# EAGLE design LLC_Demo_Board (EAGLE 9.5.2)
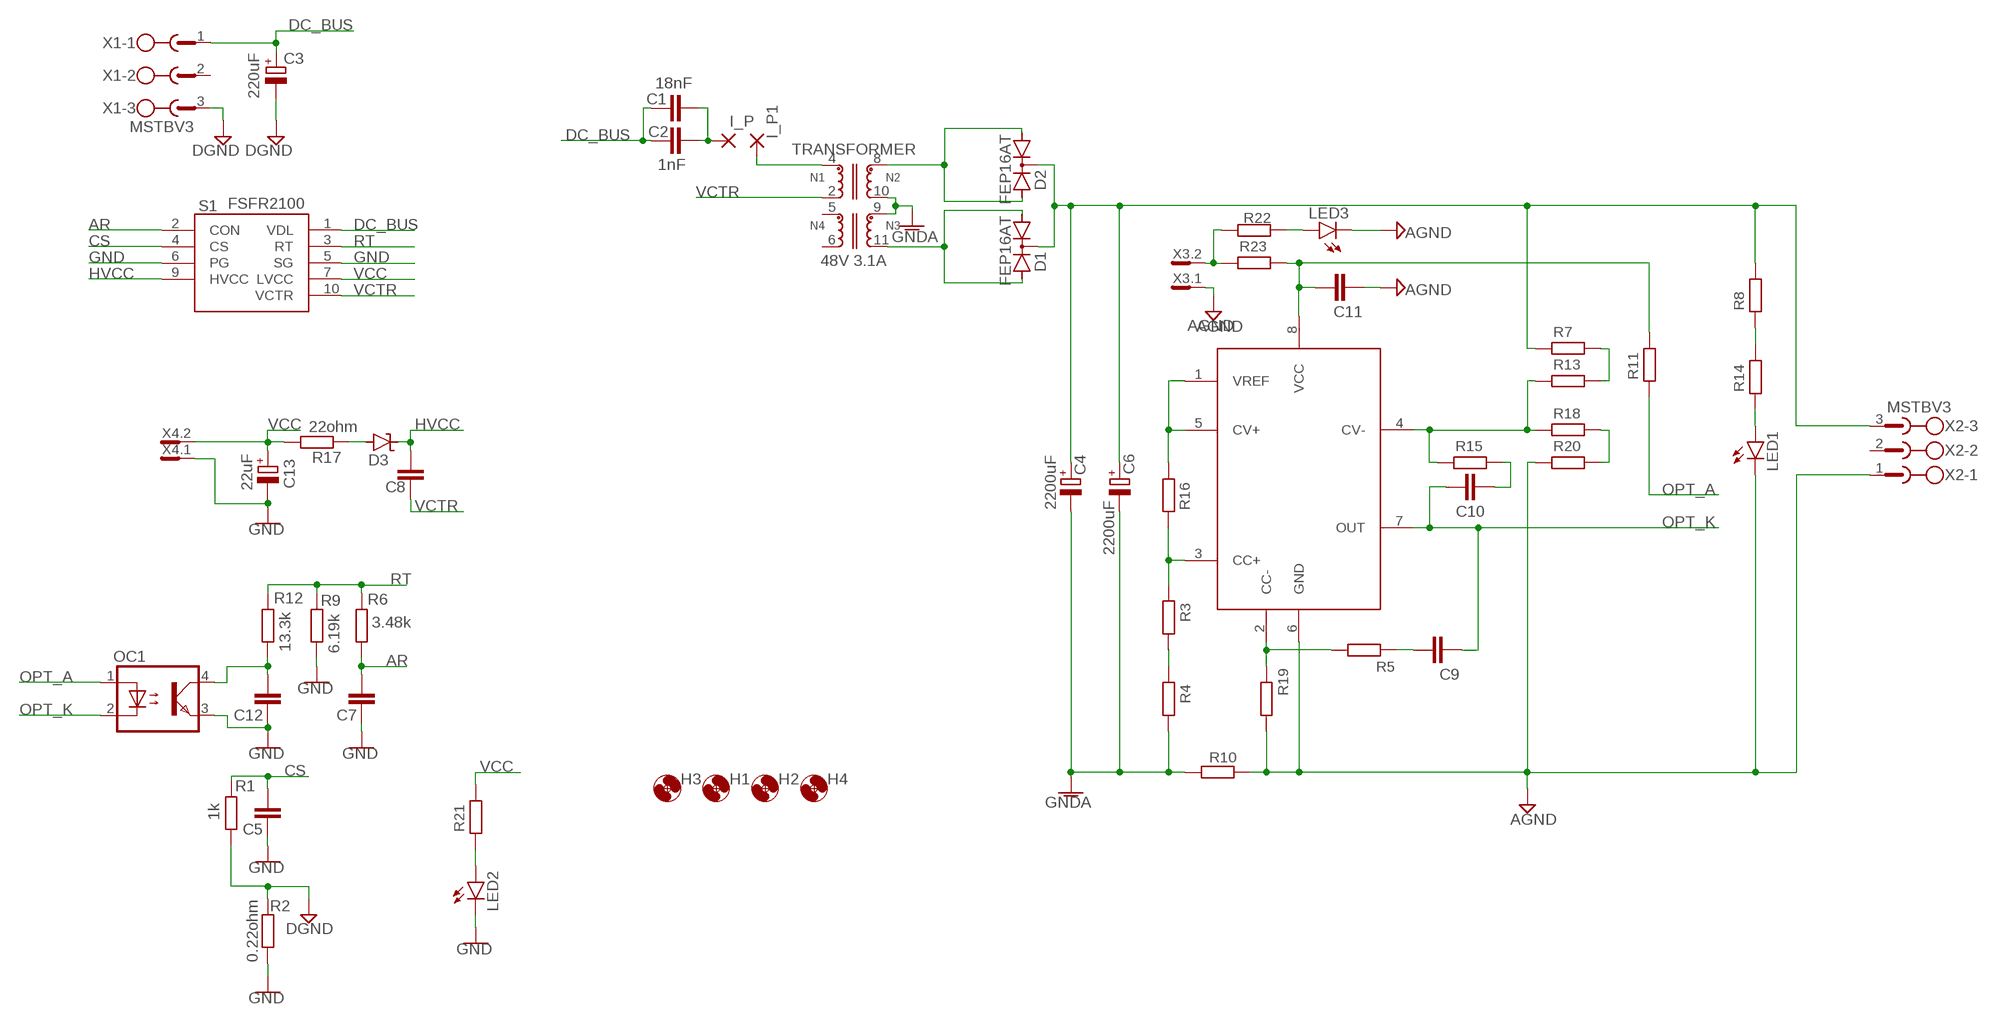
[diagram p0: schematic, sheet 1]

## Parts
C1  18nF  C-EU075-063X106  [C075-063X106]
C2  1nF  C-EU150-072X183  [C150-072X183]
C3  220uF  CPOL-EUE10-30  [EB30D]
C4  2200uF  CPOL-EUE7.5-18  [E7,5-18]
C5  100pF  C-EUC0805  [C0805]
C6  2200uF  CPOL-EUE7.5-18  [E7,5-18]
C7  220nF  C-EUC0805  [C0805]
C8  150nF  C-EUC1206  [C1206]
C9  2.2nF  C-EUC1206  [C1206]
C10  2.2nF  C-EUC1206  [C1206]
C11  22uF  C-EUC0805  [C0805]
C12  12nF  C-EUC0805  [C0805]
C13  22uF  CPOL-EU153CLV-0605  [153CLV-0605]
D1  FEP16AT  [TO220ABS]
D2  FEP16AT  [TO220ABS]
D3  SUPPRESSOR-SMBJ  [SMBJ]
H1  MOUNT-HOLE4.1  [4,1]
H2  MOUNT-HOLE4.1  [4,1]
H3  MOUNT-HOLE4.1  [4,1]
H4  MOUNT-HOLE4.1  [4,1]
I_P  3,81/1,4  [3,81/1,4]
I_P1  3,81/1,4  [3,81/1,4]
IC1  1039-2224 / TSM1011ID SO-8 Constant Voltage and Constant Current Controller  TSM1011  [SO-8]
LED1  LED5MM  [LED5MM]
LED2  LED5MM  [LED5MM]
LED3  LED5MM  [LED5MM]
OC1  1039-2189 / Opto coupler CEL-Renesas PS2561DL2-1Y-V-E3-A (8mm creepage ) CTR:50-400  PS2561DL2-1_OPTO  [PS2561DL2-1_OPTO]
R1  1k  R-EU_R0805  [R0805]
R2  0.22ohm  R-EU_R2512  [R2512]
R3  500ohm  R-EU_R0805  [R0805]
R4  500ohm  R-EU_R0805  [R0805]
R5  22k  R-EU_R1206  [R1206]
R6  3.48k  R-EU_R0805  [R0805]
R7  180k  R-EU_R1206  [R1206]
R8  1029-3175 / RES 0805 22K %1  R-EU_R1206  [R1206]
R9  6.19k  R-EU_R0805  [R0805]
R10  50m  R-EU_R2512  [R2512]
R11  100ohm  R-EU_R1206  [R1206]
R12  13.3k  R-EU_R0805  [R0805]
R13  12k  R-EU_R1206  [R1206]
R14  1029-3175 / RES 0805 22K %1  R-EU_R1206  [R1206]
R15  22k  R-EU_R1206  [R1206]
R16  15k  R-EU_R0805  [R0805]
R17  22ohm  R-EU_R0805  [R0805]
R18  4.99k  R-EU_R1206  [R1206]
R19  1k  R-EU_R0805  [R0805]
R20  4.99k  R-EU_R1206  [R1206]
R21  1029-3175 / RES 0805 22K %1  R-EU_R1206  [R1206]
R22  1029-3175 / RES 0805 22K %1  R-EU_R1206  [R1206]
R23  1k  R-EU_R1206  [R1206]
S1  FSFR2100  [FSFR2100]
TRANSFORMER  48V 3.1A  WE-LLCR_ETD34_760895451  [WE-LLCR_ETD34]
X1  MSTBV3  [MSTBV3]
X2  MSTBV3  [MSTBV3]
X3  İKİLİ MOLEX  MCV2  [MCV2]
X4  İKİLİ MOLEX  MCV2  [MCV2]

## Nets
AGND: C11.1 IC1.6(GND) LED1.K(C) LED3.K(C) R10.2 R19.1 R20.2 X2.1 X3.1
AR: C7.1 R6.2 S1.2(CON)
CS: C5.1 R1.2 S1.4(CS)
DC_BUS: C1.1 C2.1 C3.+ S1.1(VDL) X1.1
DGND: C3.- R1.1 R2.2 X1.3
GND: C5.2 C7.2 C12.2 C13.- LED2.K(C) OC1.3 R2.1 R9.2 S1.5(SG) S1.6(PG) X4.1
GNDA: C4.- C6.- R4.1 R10.1 TRANSFORMER.9 TRANSFORMER.10
HVCC: C8.1 D3.C S1.9(HVCC)
N$1: R22.1 R23.2 X3.2
N$2: C1.2 C2.2 I_P.1(P)
N$3: R8.2 R14.1
N$4: D3.A R17.1
N$5: D1.A1 D1.A2 TRANSFORMER.11
N$6: D2.A1 D2.A2 TRANSFORMER.8
N$7: C12.1 OC1.4 R12.2
N$8: LED2.A R21.2
N$9: LED1.A R14.2
N$10: LED3.A R22.2
N$18: I_P1.1(P) TRANSFORMER.4
N$19: IC1.1(VREF) IC1.5(CV+) R16.2
N$36: C9.2 R5.2
N$37: C10.2 R15.2
N$38: IC1.4(CV-) R13.2 R15.1 R18.2
N$39: IC1.2(CC-) R5.1 R19.2
N$40: IC1.3(CC+) R3.2 R16.1
N$44: C11.2 IC1.8(VCC) R11.1 R23.1
N$45: R18.1 R20.1
N$55: R7.1 R13.1
N$56: R3.1 R4.2
OPT_A: OC1.1 R11.2
OPT_K: C9.1 C10.1 IC1.7(OUT) OC1.2
RT: R6.1 R9.1 R12.1 S1.3(RT)
VCC: C13.+ R17.2 R21.1 S1.7(LVCC) X4.2
VCTR: C8.2 S1.10(VCTR) TRANSFORMER.2
VDC+: C4.+ C6.+ D1.C D2.C R7.2 R8.1 X2.3
Unconnected: TRANSFORMER.5 TRANSFORMER.6 X1.2 X2.2

## Library data of the parts
C1 C2 = rcl:C-EU: CAPACITOR, European symbol; SPICEPREFIX: C
C3 = rcl:CPOL-EU: POLARIZED CAPACITOR, European symbol; SPICEPREFIX: C
C4 C6 C13 = rcl:CPOL-EU: POLARIZED CAPACITOR, European symbol
C5 C7-C12 = rcl:C-EU: CAPACITOR, European symbol
D1 D2 = diode:FEP16AT: DIODE dual ultra-fast recovery rectifier, common cathode
D3 = diode:SUPPRESSOR-: Suppressor diode
H1-H4 = holes:MOUNT-HOLE: MOUNTING HOLE with drill center marker
I_P I_P1 = wirepad:3,81/1,4: THROUGH-HOLE PAD
IC1 = mutlu:TSM1011
LED1-LED3 = led:LED: LED OSRAM: - CHIPLED LG R971, LG N971, LY N971, LG Q971, LY Q971, LO R971, LY R971 LH N974, LH R974 LS Q976, LO Q976, LY Q976 LO Q996 - Hyper CHIPLED LW Q18S LB Q993, LB Q99A, LB R99A - SideLED LS A670, LO A670, LY A670, LG A670, LP A670 LB A673, LV A673, LT A673, LW A673 LH A674 LY A675 LS A676, LA A676, LO A676, LY A676, LW A676 LS A679, LY A679, LG A679 - Hyper Micro SIDELED® LS Y876, LA Y876, LO Y876, LY Y876 LT Y87S - SmartLED LW L88C, LW L88S LB L89C, LB L89S, LG L890 LS L89K, LO L89K, LY L89K LS L896, LA L896, LO L896, LY L896 - TOPLED LS T670, LO T670, LY T670, LG T670, LP T670 LSG T670, LSP T670, LSY T670, LOP T670, LYG T670 LG T671, LOG T671, LSG T671 LB T673, LV T673, LT T673, LW T673 LH T674 LS T676, LA T676, LO T676, LY T676, LB T676, LH T676, LSB T676, LW T676 LB T67C, LV T67C, LT T67C, LS T67K, LO T67K, LY T67K, LW E67C LS E67B, LA E67B, LO E67B, LY E67B, LB E67C, LV E67C, LT E67C LW T67C LS T679, LY T679, LG T679 LS T770, LO T770, LY T770, LG T770, LP T770 LB T773, LV T773, LT T773, LW T773 LH T774 LS E675, LA E675, LY E675, LS T675 LS T776, LA T776, LO T776, LY T776, LB T776 LHGB T686 LT T68C, LB T68C - Hyper Mini TOPLED® LB M676 - Mini TOPLED Santana® LG M470 LS M47K, LO M47K, LY M47K Source: http://www.osram.convergy.de LUXEON: - LUMILED® LXK2-PW12-R00, LXK2-PW12-S00, LXK2-PW14-U00, LXK2-PW14-V00 LXK2-PM12-R00, LXK2-PM12-S00, LXK2-PM14-U00 LXK2-PE12-Q00, LXK2-PE12-R00, LXK2-PE12-S00, LXK2-PE14-T00, LXK2-PE14-U00 LXK2-PB12-K00, LXK2-PB12-L00, LXK2-PB12-M00, LXK2-PB14-N00, LXK2-PB14-P00, LXK2-PB14-Q00 LXK2-PR12-L00, LXK2-PR12-M00, LXK2-PR14-Q00, LXK2-PR14-R00 LXK2-PD12-Q00, LXK2-PD12-R00, LXK2-PD12-S00 LXK2-PH12-R00, LXK2-PH12-S00 LXK2-PL12-P00, LXK2-PL12-Q00, LXK2-PL12-R00 Source: www.luxeon.com KINGBRIGHT: KA-3528ASYC Source: www.kingbright.com
OC1 = enko:PS2561DL2-1_OPTO
R1-R23 = rcl:R-EU_: RESISTOR, European symbol
S1 = SamacSys_Parts:FSFR2100: Power Switch Hi Side/Lo Side 9-Pin SIP Source: Datasheet <https://www.onsemi.com/pub/Collateral/FSFR2100-D.pdf>; DESCRIPTION: Power Switch Hi Side/Lo Side 9-Pin SIP; HEIGHT: 12mm; MANUFACTURER_NAME: ON Semiconductor; MANUFACTURER_PART_NUMBER: FSFR2100; MOUSER_PART_NUMBER: 512-FSFR2100; MOUSER_PRICE-STOCK: https://www.mouser.co.uk/ProductDetail/ON-Semiconductor-Fairchild/FSFR2100?qs=EsHZHwLKyZ1uSWmF0BsHAQ%3D%3D; RS_PART_NUMBER: 6710185P; RS_PRICE-STOCK: http://uk.rs-online.com/web/p/products/6710185P
TRANSFORMER = 760895451_Eagle_WE-LLCR_rev19a:WE-LLCR_ETD34: WE-LLCR Resonant Converter Characteristics Transformer for high efficiency power supply Input voltage 360–400 VDC Switching frequency 70–120 kHz Output power 150 W–250 W Testing voltage 4 kVAC Litz wire for low eddy current losses Defined leakage inductance for use without additional resonant inductor Applications Power supplies for PC, netbook, LED lighting and other power supplies High efficient resonant converters The "Value"shown for the Symbol and Packaging is Output Voltage1 Output Current1 <https://katalog.we-online.com/media/images/v2/o14804v209%20Family_WE-LLCR.jpg> Details see: https://katalog.we-online.com/en/pbs/WE-LLCR Updated by Yingchun,Shan 2019-08-27 2019(C) Wurth Elektronik; DATASHEET-URL: https://katalog.we-online.com/pbs/datasheet/760895451.pdf; FSWITCH: 70-120kHz; ISAT: 2A; L: 600uH; LSMIN: 100uH; N: 35:8:8:3; PART-NUMBER: 760895451; RDC1: 260mOhm; RDC2: 26.5mOhm; RDC3: 26.5mOhm; RDC4: 145mOhm; VAUX: 18V; VI: 360-400V(DC)
X1 X2 = con-phoenix-508:MSTBV3: PHOENIX; MPN: MSTBV 2,5/3-GF-5.08; OC_FARNELL: 1792793; OC_NEWARK: 69R9846
X3 X4 = con-phoenix-381_l:MCV2: Mini-Combicon 3.81mm vertikal 2polig (ohne Gegenstecker)

## Board
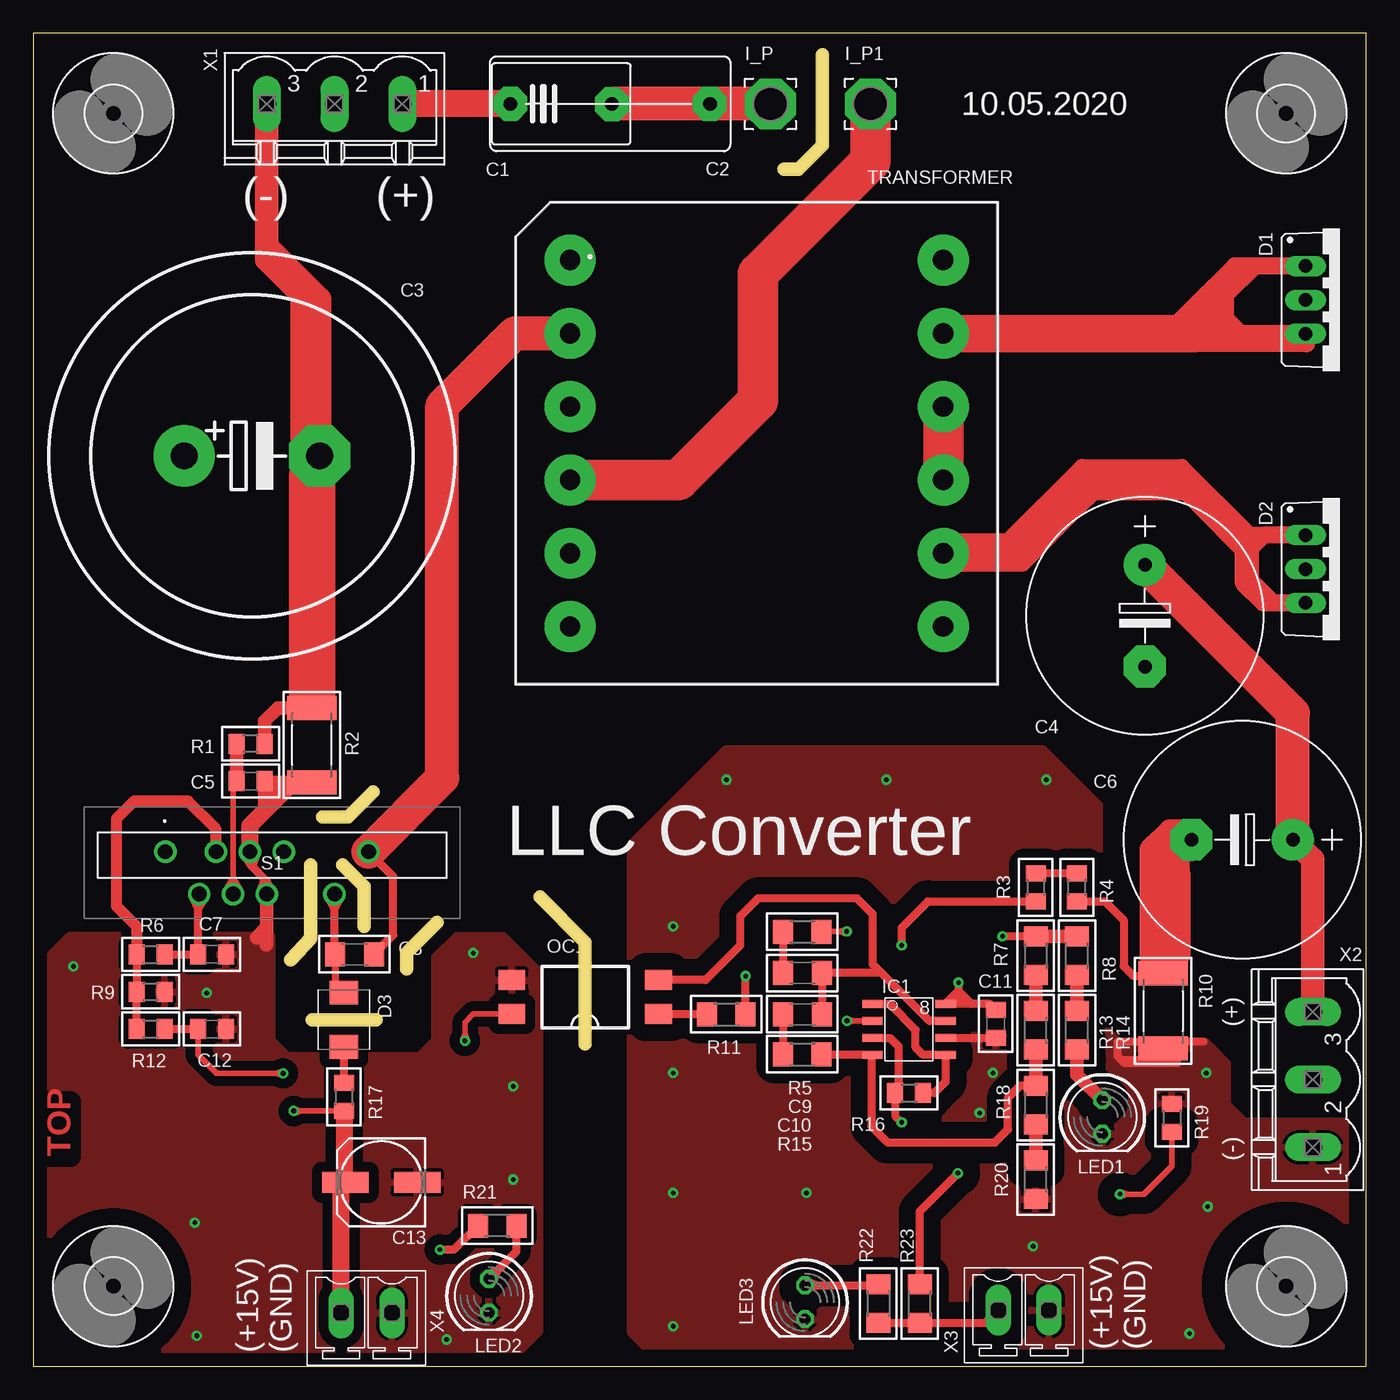
[diagram p1: board, top side]
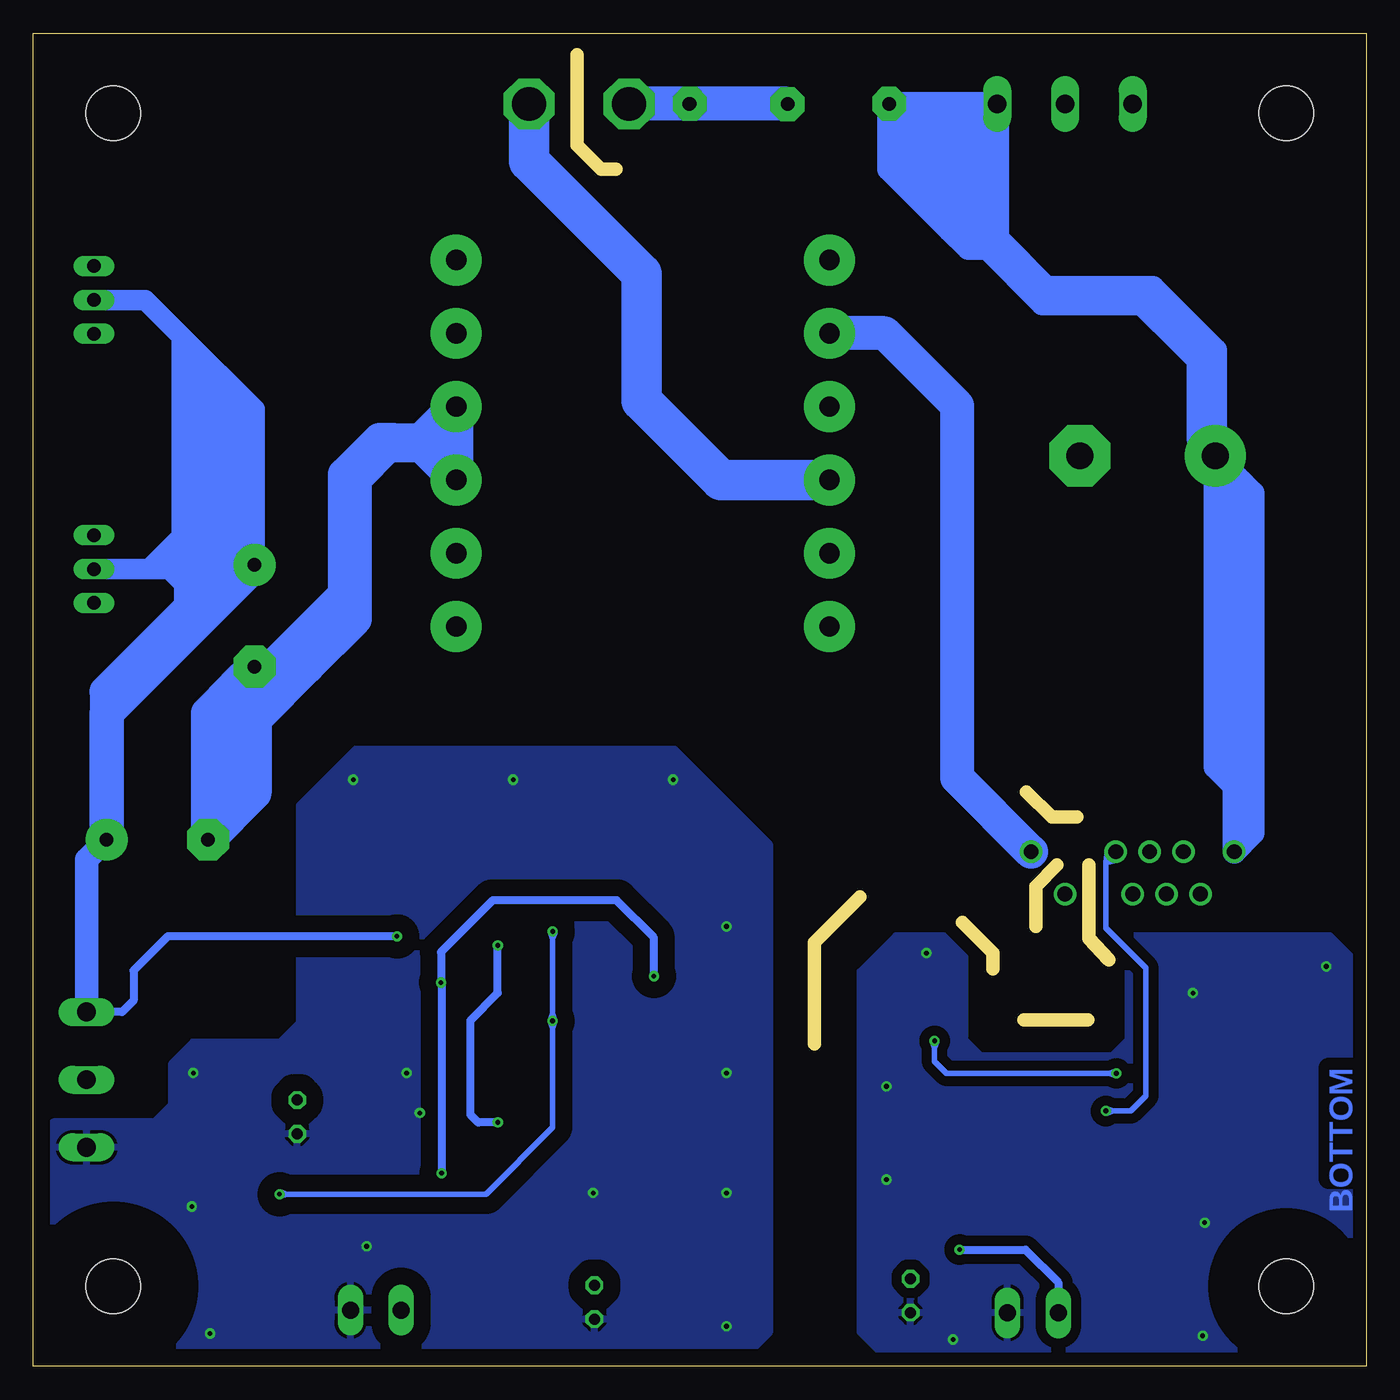
[diagram p2: board, bottom side, seen from below]

Size 100 x 100 mm. Coordinates in mm from the lower left corner, seen from the top.
Outline: 0,0 100,0 100,100 0,100 0,0
Copper layers (1*16): Top 0.035mm / dielectric 1.5mm / Bottom 0.035mm
Design rules "default *": minimum track width 6mil, minimum drill 0.35mm, track to track 30mil, track to pad 30mil, pad to pad 30mil, via to via 30mil, smd to smd 30mil, copper to edge 40mil, drill to drill 6mil, minimum pad ring 10mil, minimum via ring 8mil, stop-mask expansion 4mil, vias tented up to drill 0mil, thermal gap 10mil
Milling: 14 lines

### Footprints (pad centres in the part's own frame; a part is rotated, then mirrored left to right if it is on the bottom)
C075-063X106 = drill 0.914 octagon: 1 -3.81,0; 2 3.81,0
C150-072X183 = drill 1.016 octagon: 1 -7.493,0; 2 7.493,0
EB30D = drill 2.007 pad 4.597: + -5.08,0 | drill 2.007 pad 4.597 octagon: - 5.08,0
E7,5-18 = drill 1.016 pad 3.15: + -3.81,0 | drill 1.016 pad 3.15 octagon: - 3.81,0
C0805 = smd 1.2 x 1.5: 1 -1.05,0; 2 1.05,0
C1206 = smd 1.5 x 1.8: 1 -1.45,0; 2 1.45,0
153CLV-0605 = smd 3.5 x 1.6: + 2.7,0; - -2.7,0
TO220ABS = drill 1.016 long: A1 -2.54,-2.54; A2 2.54,-2.54; C 0,-2.54
SMBJ = smd 1.78 x 2.16: A 2.04,0; C -2.03,0
4,1 = hole 4.1: 0,0
3,81/1,4 = drill 2.54 pad 3.81 octagon: 1 0,0
SO-8 = smd 1.524 x 0.61: 1 -2.743,1.27; 2 -2.743,0; 3 -2.743,-1.27; 4 -2.743,-2.54; 5 2.743,-2.54; 6 2.743,-1.27; 7 2.743,0; 8 2.743,1.27
LED5MM = drill 0.813 octagon: A -1.27,0; K 1.27,0
PS2561DL2-1_OPTO = smd 1.5 x 2: 1 -1.27,-5.5; 2 1.27,-5.5; 3 1.27,5.5; 4 -1.27,5.5
R0805 = smd 1.2 x 1.5: 1 -1.05,0; 2 1.05,0
R2512 = smd 1.8 x 3.7: 1 -2.8,0; 2 2.8,0
R1206 = smd 1.5 x 1.8: 1 -1.447,0; 2 1.447,0
FSFR2100 = drill 1.12 pad 1.68: 1 0,0; 2 2.54,-3.18; 3 3.81,0; 4 5.08,-3.18; 5 6.35,0; 6 7.62,-3.18; 7 8.89,0; 9 12.7,-3.18; 10 15.24,0
WE-LLCR_ETD34 = drill 1.524 pad 3.81: 1 -14,13.75; 2 -14,8.25; 3 -14,2.75; 4 -14,-2.75; 5 -14,-8.25; 6 -14,-13.75; 7 14,-13.75; 8 14,-8.25; 9 14,-2.75; 10 14,2.75; 11 14,8.25; 12 14,13.75
MSTBV3 = drill 1.397 long: 1 -5.08,0; 2 0,0; 3 5.08,0
MCV2 = drill 1.27 pad 1.905 long: 1 -1.905,0; 2 1.905,0

### Placement (x,y rotation side)
C1  39.6,94.72 0 top
C2  43.28,94.72 0 top
C3  16.4,68.3 0 top
C4  83.4,56.3 270 top
C5  16.3,43.9 0 top
C6  90.7,39.5 180 top
C7  13.4,30.9 0 top
C8  24.1,30.9 0 top
C9  57.7,29.5 180 top
C10  57.7,26.4 180 top
C11  72.2,25.7 90 top
C12  13.4,25.3 0 top
C13  26.1,13.8 180 top
D1  98,80 270 top
D2  98,59.8 270 top
D3  23.3,26 270 top
H1  6,94 0 top
H2  94,94 0 top
H3  6,6 0 top
H4  94,6 0 top
I_P  55.3,94.7 0 top
I_P1  62.8,94.7 0 top
IC1  65.7,25.9 0 top
LED1  80.2,18.7 270 top
LED2  34.19,5.28 270 top
LED3  57.9,4.8 270 top
OC1  41.4,27.7 90 top
R1  16.3,46.7 180 top
R2  20.9,46.6 90 top
R3  75.2,35.93 270 top
R4  78.3,35.93 90 top
R5  57.7,32.6 180 top
R6  8.8,30.9 0 top
R7  75.2,30.8 90 top
R8  78.3,30.8 270 top
R9  8.8,28.1 0 top
R10  84.77,26.65 270 top
R11  52,26.4 180 top
R12  8.8,25.3 0 top
R13  75.2,25.2 270 top
R14  78.3,25.2 270 top
R15  57.7,23.4 180 top
R16  65.7,20.5 0 top
R17  23.3,20.2 270 top
R18  75.2,19.6 90 top
R19  85.41,18.63 270 top
R20  75.2,14 270 top
R21  34.8,10.54 0 top
R22  63.4,4.7 90 top
R23  66.5,4.7 270 top
S1  9.9,38.6 0 top
TRANSFORMER  54.27,69.24 0 top
X1  22.6,94.7 180 top
X2  96,21.5 90 top
X3  74.3,4.2 180 top
X4  25,4 180 top

### Tracks (layer width: path | path; a pad name or v marks a point on that pad's centre or on a via)
AGND  (via drill 0.35)
  Top 0.61: IC1.6 72.18,24.63 C11.1 | 87.78,24.36 81.36,24.36 81.36,23.27 81.67,22.95 | 81.67,22.95 81.89,22.73 85.8,22.73 85.8,24.26 85.34,24.26 84.94,23.85 R10.2 83.86,22.95 81.67,22.95
  other vias: 48,3 48,13 48,22 58,13 48,33 52,44 64,44 76,44 86.74,2.45 88.11,11.98 75,9 88,22 72,22 71,19
  pour Top (isolate 1.27): 100,0 100,16.81 98.45,18.36 90.88,18.36 89.61,19.63 89.61,22.73 88.37,23.98 88.01,24.33 82.27,24.33 81.48,24.33 80.04,25.78 80.04,42.09 75.82,46.3 51.89,46.3 48.13,42.55 44.78,39.19 44.78,24.23 44.78,2.51 47.29,0
  pour Bottom (isolate 1.27): 44.78,2.51 47.29,0 100,0 100,16.81 98.45,18.36 90.88,18.36 89.61,19.63 89.61,22.73 88.01,24.33 81.48,24.33 80.04,25.78 80.04,42.09 75.82,46.3 51.89,46.3 44.78,39.19
AR
  Top 0.61: R6.2 C7.1 12.35,34.3 | 12.35,34.3 12.35,35.33 | 12.35,34.3 12.89,35.13 S1.2 11.95,35.2 12.35,34.3
  Top 1.016: 12.35,35.33 S1.2
CS
  Top 0.254: 14.98,36.54 14.98,43.63 C5.1
  Top 0.406: S1.4 14.98,36.54 | 14.98,36.54 14.98,44.16 15.25,44.42 | 14.98,36.54 14.46,35.78 S1.4 | 14.98,36.54 15.5,35.78 S1.4
  Top 0.508: 14.98,36.54 14.48,35.73 S1.4 15.48,35.73 14.98,36.54
  Top 1.016: R1.2 15.25,44.42 C5.1
DC_BUS  (via drill 1 pad 2.54)
  Top 1.778: 27.7,94.72 X1.1
  Top 2.032: C1.1 27.7,94.72
  Bottom 1.778: C3.+ 8.51,65.49 8.51,39.99 S1.1 9.9,43.54 | 9.9,43.54 9.9,66.88 C3.+ | C3.+ 11.32,44.96 9.9,43.54 | C3.+ 11.32,76.24 16,80.92 18.06,80.92 | X1.1 27.68,87.33 | 27.68,87.33 27.68,86 | 27.68,86 27.68,84.63 23.98,80.92 18.06,80.92 | C3.+ 12.6,69.57 12.6,75.46 | 12.6,75.46 12.19,75.87 16.05,79.73 | 16.05,79.73 16.95,80.63 | 16.05,79.73 24.28,79.73 28.42,83.87 | X1.1 28.42,93.96 28.42,83.87 | 12.6,75.46 18.06,80.92 | 31.22,85.24 29.77,85.24 | 29.77,85.24 28.44,85.24 27.68,86 | 31.22,85.24 29.84,83.87 28.42,83.87 | 29.77,85.24 27.68,87.33 | C1.1 35.79,89.81 31.22,85.24 | X1.1 33.61,94.7 | C1.1 35.77,94.7 33.61,94.7 | 29.77,85.24 29.77,93.62 30.18,94.03 34.39,94.03 35.08,93.34 35.08,90.81 31.19,86.92 | 31.19,86.92 30.45,86.18 | 31.19,86.92 31.19,93.14 31.04,93.29 31.53,93.79 32.93,93.79 34.16,92.56 34.16,91.67 31.37,88.88 29.58,90.67 33.61,94.7 | C1.1 31.77,90.7 31.77,90.27 27.68,94.37 X1.1
  other vias: 35.79,94.72
DGND
  Top 1.016: R1.1 17.35,48.39 18.36,49.4 19.71,49.4 R2.2
  Top 1.778: 20.9,67.72 R2.2 20.04,50.26 20.04,66.86 20.9,67.72 | 20.9,67.72 C3.- | C3.- 21.77,68.01 21.77,50.34 20.82,49.4 19.71,49.4 | C3.- 21.48,80.07 17.52,84.03 | X1.3 17.52,84.03 | C3.- 20.17,69.61 20.17,80.37 17.52,83.01 17.52,84.03
GND  (via drill 0.35)
  Top 0.61: S1.5 16.25,37.65 16.41,37.49 | S1.6 17.52,36.38 17.37,36.53 | 16.41,37.49 17.37,36.53 | 20.02,43.8 R2.1 | 16.41,37.49 16.75,38.41 S1.5 | 16.41,37.49 15.82,38.28 S1.5 | 17.37,36.53 17.02,35.61 S1.6 | 17.37,36.53 17.95,35.74 S1.6
  Top 1.016: S1.6 17.52,32.94 | 17.52,32.91 17.52,31.64 17.48,31.6 | 17.52,32.94 17.52,32.91 | 17.52,32.91 16.74,32.13 16.74,32.16 17.52,32.94 | 17.35,43.23 C5.2 17.45,43.8 20.02,43.8 | 17.35,43.23 17.35,41.73 17.39,41.69 | 18.81,43.12 18.69,43.23 17.35,43.23
  Top 1.27: S1.5 16.25,40.56 17.39,41.69 18.81,43.12 19.49,43.8 20.02,43.8
  other vias: 3,30 13,28 33,31 36,21 36,14 31,2 12.27,2.28 12.11,10.76
  pour Top (isolate 0.762): 0,0 35.4,0 38,2.6 38,29.6 35.3,32.3 35.3,32.3 31.7,32.3 30.1,30.7 30.1,24.5 28.9,23.3 19.1,23.3 17.9,24.5 17.9,32.3 17.89,32.31 2.71,32.31 0,29.6
  pour Bottom (isolate 0.762): 0,29.6 2.7,32.3 17.9,32.3 17.9,24.5 19.1,23.3 28.9,23.3 30.1,24.5 30.1,30.7 31.7,32.3 35.3,32.3 38,29.6 38,2.6 35.4,0 0,0
GNDA
  Top 0.61: R4.1 80.39,34.88 81.81,33.45 81.81,30 82.53,29.29 84.6,29.29 84.98,29.66
  Top 1.778: 86.89,38.78 C6.- | 84.77,37.38 C6.- | 85.6,35.03 85.95,35.38 | 85.95,35.38 85.95,36.91 85.88,36.98 | 85.88,36.98 85.88,38.49 C6.- | 85.88,36.98 84.98,36.08 | 84.98,36.08 83.9,35 | 83.9,35 83.9,38.76 84.64,39.5 | 84.64,39.5 C6.- | C6.- 86.61,39.78 86.61,40.16 85.29,40.16 84.64,39.5 | 85.95,35.38 85.95,30.91 85.06,30.02 84.05,30.02 83.9,30.18 83.9,35 | 84.98,36.08 84.98,29.66 R10.1
  Top 3.048: TRANSFORMER.9 TRANSFORMER.10
  Bottom 2.54: C4.- 79.44,52.49 | 73.03,69.49 70.89,69.49 | 70.89,69.49 68.27,69.49 | 79.44,52.49 75.87,56.06 75.87,66.65 73.41,69.11 | 73.41,69.11 73.03,69.49 | 68.27,69.49 TRANSFORMER.10 68.4,71.99 70.89,69.49 | 68.27,69.49 TRANSFORMER.9 70.89,69.11 | 70.89,69.49 70.89,69.11 | C4.- 83.4,48.72 | 83.4,48.72 83.4,42.99 C6.- | 83.4,48.72 83.21,48.72 79.44,52.49 | C6.- 86.89,42.55 83.4,46.04 C4.- | C6.- 86.89,49 84.95,50.94 | 84.95,50.94 C4.- | 84.95,50.94 84.95,45.5 86.89,43.56 C6.- | C4.- 82,52.49 76.61,57.89 76.61,66.9 74.02,69.49 73.03,69.49 | 73.41,69.11 70.89,69.11
HVCC
  Top 0.508: C8.1 22.65,28.68 D3.C
  Top 0.61: C8.1 22.6,30.95 22.6,34.3 | 22.6,34.3 S1.9 | 22.6,34.3 23.07,35.16 S1.9 | 22.6,34.3 22.13,35.16 S1.9
N$1
  Top 0.61: R22.1 R23.2 71.45,3.25 X3.2
N$2  (via drill 1 pad 2.54)
  Top 1.778: C1.2 C2.2 55.28,94.72 I_P.1
  Top 2.54: I_P.1 50.79,94.7 C2.2 43.43,94.72 v43.41,94.69
  Bottom 1.778: 55.28,94.72 I_P.1 | C2.2 v50.75,94.72
  Bottom 2.54: C1.2 v50.75,94.72 | C2.2 55.28,94.72
N$3
  Top 0.508: 78.3,29.01 R8.2
  Top 1.016: R14.1 78.3,29.01
N$4
  Top 0.61: R17.1 D3.A
N$5
  Top 1.27: 90.6,77.46 D1.A2 95.51,76.71 87.17,76.71 | 90.6,77.46 89.01,77.46 | 89.01,77.46 87.86,77.46 | 87.86,77.46 86.71,77.46 | 86.71,77.46 85.06,77.46 | 85.06,77.46 67.8,77.46 67.74,77.52 68.24,77.52 TRANSFORMER.11 | D1.A1 92.96,82.54 91.63,82.54 | 91.63,82.54 90.95,82.54 | 90.95,82.54 90.44,82.54 | 90.44,82.54 90.14,82.54 88.52,80.92 | 87.86,80.26 87.86,78.61 | 87.86,77.46 87.86,78.61 | 88.52,80.92 87.86,80.26 | 87.86,78.61 88.47,78 | 88.47,78 89.01,77.46 | 86.71,77.46 87.49,78.25 | 87.49,78.25 87.86,78.61 | TRANSFORMER.11 69.03,78.25 87.49,78.25 | TRANSFORMER.11 69.05,76.71 87.17,76.71 | 87.17,76.71 88.47,78 | 90.6,77.46 89.43,78.63 | 89.43,78.63 88.67,79.39 88.67,80.26 | 88.67,80.77 88.52,80.92 | 88.67,80.26 88.67,80.77 | 90.44,82.54 88.67,80.77 | 87.86,80.26 85.06,77.46 | 90.95,82.54 89.43,81.02 | 89.43,81.02 88.67,80.26 | 89.43,81.02 89.43,80.34 | 89.43,80.34 89.43,78.63 | 91.63,82.54 89.43,80.34
N$6
  Top 1.27: D2.A1 92.3,62.34 | 90.8,62.34 91.23,62.34 | 90.8,62.34 88.62,64.52 87.53,64.52 | 78.46,64.52 77.24,64.52 | 77.24,64.52 77.14,64.52 73.61,60.99 TRANSFORMER.8 | 90.8,59.49 90.8,58.73 92.27,57.26 D2.A2 93.02,57.26 91.31,58.98 | 90.8,59.49 90.8,60.83 | 90.8,61.25 90.8,62.34 | 92.3,62.34 90.8,60.83 | TRANSFORMER.8 69.15,61.87 73.13,61.87 78.69,67.44 86.13,67.44 91.23,62.34 | 91.23,62.34 92.3,62.34 | 90.8,60.83 90.8,61.25 | 90.8,61.25 87.53,64.52 | 87.53,64.52 86.44,65.61 | 86.44,65.61 85.34,66.7 79.43,66.7 77.24,64.52 | TRANSFORMER.8 69.01,60.25 74.19,60.25 78.46,64.52 | 78.46,64.52 79.55,65.61 86.44,65.61 | 91.31,58.98 90.8,59.49 | 91.23,62.34 91.31,62.26 91.31,58.98
N$7  (via drill 0.35)
  Top 0.406: C12.1 12.35,23.36 13.74,21.97 18.22,21.97 | 18.22,21.97 v18.75,21.97 | v32.38,24.41 32.38,24.93 | 32.38,24.93 32.38,25.81 33.01,26.43 OC1.4 | 18.22,21.97 18.69,21.81 v18.75,21.97 | 18.22,21.97 18.69,22.14 v18.75,21.97 | 32.38,24.93 32.22,24.47 v32.38,24.41 | 32.38,24.93 32.55,24.47 v32.38,24.41
  Top 0.61: R12.2 C12.1
  Bottom 0.406: v18.75,21.97 19.27,21.97 | 19.27,21.97 31.5,21.97 32.38,22.86 32.38,23.88 | 32.38,23.88 v32.38,24.41 | 19.27,21.97 18.8,22.14 v18.75,21.97 | 19.27,21.97 18.8,21.81 v18.75,21.97 | 32.38,23.88 32.55,24.35 v32.38,24.41 | 32.38,23.88 32.22,24.35 v32.38,24.41
N$8
  Top 0.61: LED2.A 34.76,7.13 | 34.76,7.13 36.24,8.61 R21.2 | 34.76,7.13 34.07,6.89 LED2.A | 34.76,7.13 34.52,6.44 LED2.A
N$9
  Top 1.016: LED1.A 78.3,21.87 R14.2
N$10
  Top 0.61: LED3.A 58.71,6.07 | 58.71,6.07 63.32,6.07 R22.2 | 58.71,6.07 58.06,6.39 LED3.A | 58.71,6.07 58.06,5.75 LED3.A
N$18
  Top 3.048: TRANSFORMER.4 48.41,66.49 54.36,72.44 54.36,81.97 62.8,90.41 I_P1.1
  Bottom 3.048: TRANSFORMER.4 48.41,66.49 54.36,72.44 54.36,81.97 62.8,90.41 I_P1.1
N$19
  Top 0.61: R16.2 67.62,20.5 68.44,21.33 IC1.5 66.76,23.36 66.19,23.93 66.19,25.25 64.27,27.17 IC1.1
N$36
  Top 0.61: R5.2 C9.2
N$37
  Top 0.61: C10.2 R15.2
N$38
  Top 0.61: R15.1 59.19,23.36 IC1.4 62.87,23.27 62.87,18.01 64.08,16.79 72.16,16.79 73.13,17.75 73.13,20.14 74.03,21.05 R18.2
  Top 1.016: R18.2 R13.2
N$39  (via drill 0.35)
  Top 0.406: IC1.2 61.56,25.9 | 61.56,25.9 v61.05,25.9 v61.04,25.91 | v81.53,12.9 82.06,12.9 | 82.06,12.9 83.31,12.9 85.41,15 R19.2 | v61.04,32.61 60.51,32.61 | 60.51,32.61 59.16,32.61 R5.1 | 61.56,25.9 61.1,26.07 v61.04,25.91 | 61.56,25.9 61.1,25.74 v61.04,25.91 | 82.06,12.9 81.59,13.07 v81.53,12.9 | 82.06,12.9 81.59,12.74 v81.53,12.9 | 60.51,32.61 60.98,32.45 v61.04,32.61 | 60.51,32.61 60.98,32.78 v61.04,32.61
  Bottom 0.406: v61.04,25.91 61.04,25.38 | 61.04,25.38 61.04,17.9 66.04,12.9 81.01,12.9 | 81.01,12.9 v81.53,12.9 | v61.04,25.91 61.04,26.43 | 61.04,26.43 61.04,32.09 | 61.04,32.09 v61.04,32.61 | 61.04,25.38 61.2,25.85 v61.04,25.91 | 61.04,25.38 60.88,25.85 v61.04,25.91 | 61.04,26.43 60.88,25.97 v61.04,25.91 | 61.04,26.43 61.2,25.97 v61.04,25.91 | 81.01,12.9 81.48,12.74 v81.53,12.9 | 81.01,12.9 81.48,13.07 v81.53,12.9 | 61.04,32.09 61.2,32.56 v61.04,32.61 | 61.04,32.09 60.87,32.55 v61.04,32.61
N$40  (via drill 0.35)
  Top 0.61: IC1.3 64.27,24.63 64.92,23.98 64.92,20.87 R16.1 64.65,18.79 v65.15,18.29 | v65.15,31.57 65.15,32.92 67.11,34.88 R3.2
  Bottom 0.61: v65.15,18.29 66.62,18.29 67.21,18.87 67.21,25.93 65.15,27.99 v65.15,31.57
N$44  (via drill 0.35)
  Top 0.61: 70.39,27.17 71.78,27.17 C11.2 | 70.39,27.17 IC1.8 69.42,28.14 | R23.1 66.5,11.61 v69.37,14.48 | 69.42,27.6 v69.42,28.78 69.42,28.14 | 69.42,28.14 70.39,27.17 | R11.1 v53.45,29.25 v53.44,29.26
  Bottom 0.61: v69.37,14.48 69.37,28.73 v69.42,28.78 69.42,31.06 65.53,34.95 56.24,34.95 53.44,32.16 v53.44,29.26
N$45
  Top 1.016: R20.1 R18.1
N$55
  Top 1.016: R7.1 R13.1
N$56
  Top 0.61: R4.2 R3.1
OPT_A
  Top 0.61: OC1.1 50.52,26.43 R11.2
OPT_K
  Top 0.61: C10.1 C9.1 63.64,29.5 | IC1.7 67.24,25.9 63.64,29.5 | 63.64,29.5 62.99,30.15 62.99,33.91 61.8,35.1 54.38,35.1 53.03,33.76 53.03,31.57 50.43,28.97 OC1.2
RT
  Top 0.61: R6.1 7.75,30.5 R9.1 R12.1
  Top 0.813: S1.3 13.71,40.29 11.58,42.42 7.57,42.42 6.22,41.07 6.22,34.52 7.75,32.99 7.75,30.5
VCC  (via drill 0.35)
  Top 0.406: v19.53,19.15 20.06,19.15 | 20.06,19.15 R17.2 | 20.06,19.15 19.59,19.32 v19.53,19.15 | 20.06,19.15 19.59,18.99 v19.53,19.15
  Top 0.61: R21.1 31.55,8.74 v30.5,8.74
  Top 1.27: X4.2 23.09,13.49 23.3,13.7 | 23.3,13.7 C13.+ | R17.2 23.3,13.7
  Bottom 0.406: S1.7 19.36,38.03 | S1.7 19.53,37.86 19.53,37.76 | v19.53,19.15 19.01,19.15 | 19.01,19.15 17.65,19.15 16.53,20.28 16.53,29.88 19.53,32.89 19.53,37.76 | 19.01,19.15 19.47,18.99 v19.53,19.15 | 19.01,19.15 19.47,19.32 v19.53,19.15 | 19.53,37.76 19.42,38.68 S1.7 | 19.53,37.76 18.64,37.98 S1.7
  Bottom 0.61: v30.5,8.74 25.55,8.74 23.09,6.28 X4.2
VCTR
  Top 0.61: 25.14,31.31 C8.2 27,32.35 27,36.74 25.93,37.81 | 25.93,37.81 S1.10 | 25.93,37.81 25.65,38.75 S1.10 | 25.93,37.81 24.99,38.09 S1.10
  Top 2.54: S1.10 30.68,44.14 30.68,72.06 36.11,77.49 TRANSFORMER.2
  Bottom 2.54: S1.10 30.68,44.14 30.68,72.06 36.11,77.49 TRANSFORMER.2
VDC+  (via drill 0.35)
  Top 0.508: R7.2 75.39,32.25
  Top 0.61: 95.94,26.64 X2.3 | R7.2 72.73,32.25 v72.72,32.26
  Top 1.016: R8.1 75.39,32.25
  Top 1.778: X2.3 96,38.01 C6.+
  Top 2.54: C6.+ 94.51,49 C4.+
  Bottom 0.61: v72.72,32.26 89.92,32.26 92.48,29.69 92.48,27.43 93.33,26.58 X2.3
  Bottom 1.524: D1.C 91.61,80 88.86,77.25 | 83.4,62.41 83.4,71.79 88.86,77.25 | 83.4,62.41 C4.+ 83.71,59.8 86.01,59.8 | 91.31,59.8 90.01,59.8 | 89.8,59.8 89.56,59.8 | 89.56,59.8 86.01,59.8 | 83.4,62.41 84.96,60.85 | 84.96,60.85 86.01,59.8 | 91.31,59.8 89.97,61.14 | 89.97,61.14 88.86,62.25 88.86,77.25 | D2.C 91.31,59.8 | 87.99,61.82 90.01,59.8 | 89.97,61.14 87.55,61.14 85.25,61.14 | 84.96,60.85 85.25,61.14 | 85.25,61.14 85.25,62.43 84.25,63.42 84.25,70.97 87.47,74.18 88.29,75.01 88.09,75.21 | 90.01,59.8 89.8,59.8 | 89.8,59.8 87.55,57.56 | 89.56,59.8 88.68,58.92 88.68,56.43
  Bottom 1.778: C6.+ 96,38.01 X2.3
  Bottom 2.54: 87.47,74.18 87.47,62.34 | 87.99,61.82 87.47,62.34 | 87.47,62.34 86.18,63.63 | 85.98,71.2 85.22,70.43 85.22,64.11 85.7,64.11 86.18,63.63 | 86.18,63.63 86.18,61.92 | 83.71,59.8 94.51,49 C6.+ 94.51,50.6 88.68,56.43 87.55,57.56 87.55,61.14

### Text on the board
Top: TOP
Bottom: BOTTOM
tNames: 10.05.2020 | (-) | (+) | LLC Converter | (+) | (-) | (+15V) / (GND) | (+15V) / (GND)